# EAGLE design PSU200A_Ctrl (EAGLE 9.5.2)
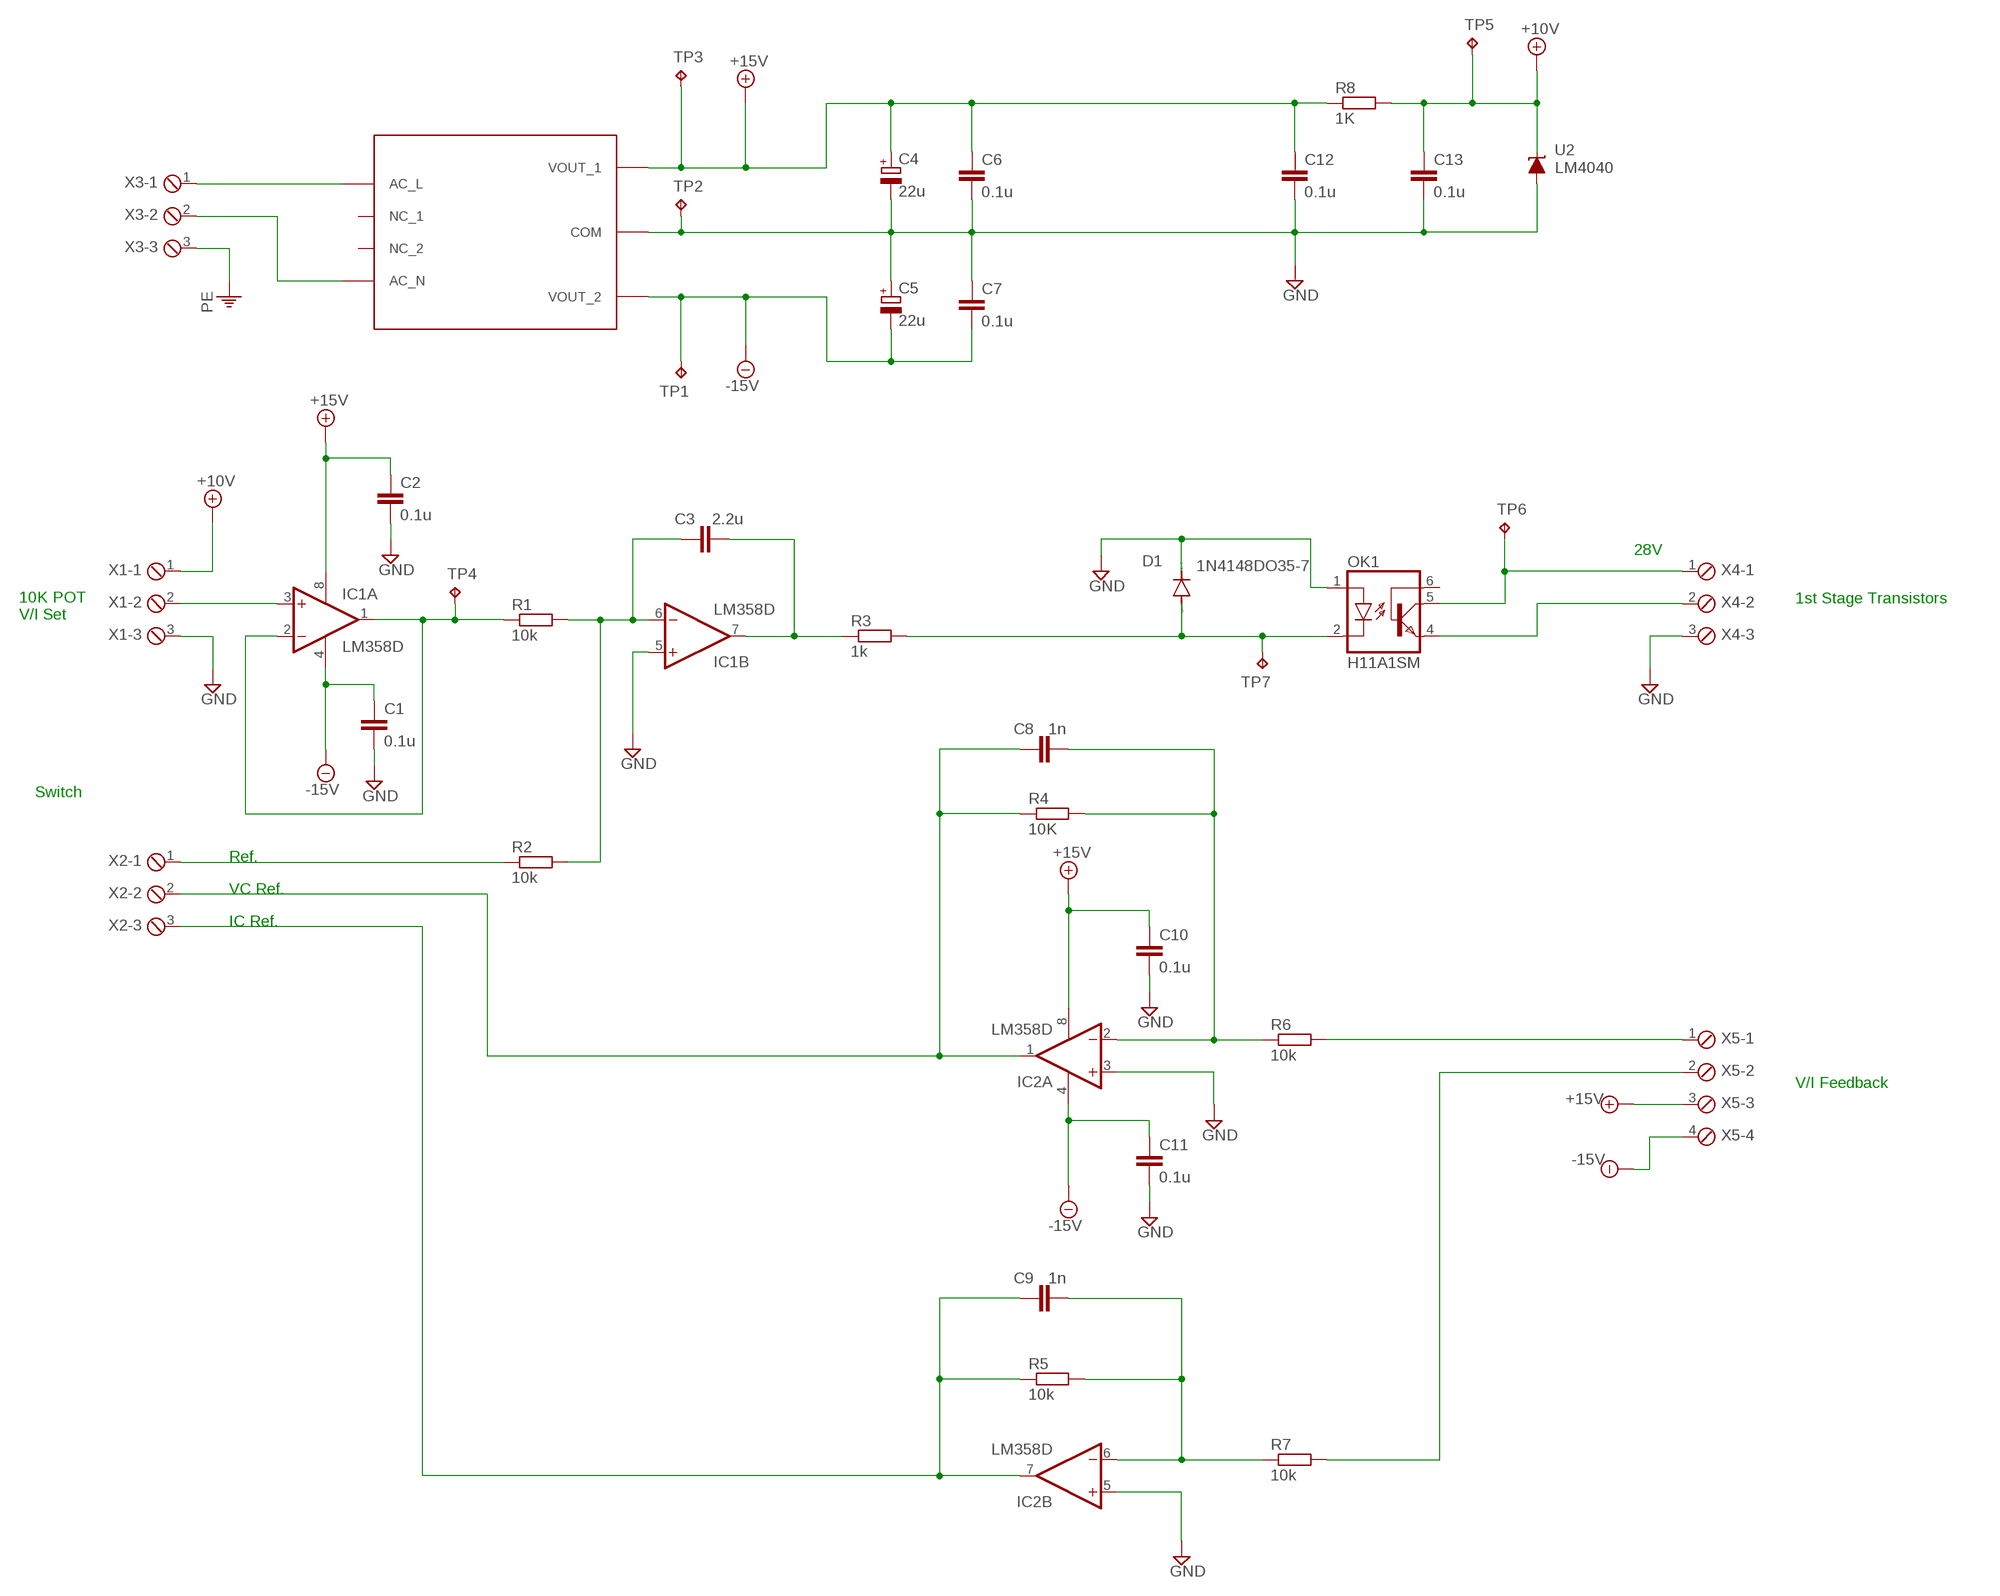
[diagram p0: schematic, sheet 1]

## Parts
C1  0.1u  C-EUC1206  [C1206]
C2  0.1u  C-EUC1206  [C1206]
C3  2.2u  C-EUC1206  [C1206]
C4  22u  CPOL-EUB  [PANASONIC_B]
C5  22u  CPOL-EUB  [PANASONIC_B]
C6  0.1u  C-EUC1206  [C1206]
C7  0.1u  C-EUC1206  [C1206]
C8  1n  C-EUC1206  [C1206]
C9  1n  C-EUC1206  [C1206]
C10  0.1u  C-EUC1206  [C1206]
C11  0.1u  C-EUC1206  [C1206]
C12  0.1u  C-EUC1206  [C1206]
C13  0.1u  C-EUC1206  [C1206]
D1  1N4148DO35-7  [DO35-7]
IC1  LM358D  [SO08]
IC2  LM358D  [SO08]
OK1  H11A1SM  [DIL6-SMD]
R1  10k  R-EU_R1206  [R1206]
R2  10k  R-EU_R1206  [R1206]
R3  1k  R-EU_R1206  [R1206]
R4  10K  R-EU_R1206  [R1206]
R5  10k  R-EU_R1206  [R1206]
R6  10k  R-EU_R1206  [R1206]
R7  10k  R-EU_R1206  [R1206]
R8  1K  R-EU_R1210  [R1210]
TP1  TPPAD1-13  [P1-13]
TP2  TPPAD1-13  [P1-13]
TP3  TPPAD1-13  [P1-13]
TP4  TPPAD1-13  [P1-13]
TP5  TPPAD1-13  [P1-13]
TP6  TPPAD1-13  [P1-13]
TP7  TPPAD1-13  [P1-13]
U1  TMPM04215  [TMPM04XXX]
U2  LM4040  [TO92-]
X1  MPT3  [3POL254]
X2  MPT3  [3POL254]
X3  MPT3  [3POL254]
X4  MPT3  [3POL254]
X5  MPT4  [4POL254]

## Nets
+10V: C13.1 R8.2 TP5.TP U2.2(C) X1.1
+15V: C2.1 C4.+ C6.1 C10.1 C12.1 IC1.8(P:V+) IC2.8(P:V+) R8.1 TP3.TP U1.P$3(VOUT_1) X5.3
-15V: C1.1 C5.- C7.2 C11.1 IC1.4(P:V-) IC2.4(P:V-) TP1.TP U1.P$5(VOUT_2) X5.4
GND: C1.2 C2.2 C4.- C5.+ C6.2 C7.1 C10.2 C11.2 C12.2 C13.2 D1.C IC1.5(B:+IN) IC2.3(A:+IN) IC2.5(B:+IN) OK1.1(A) TP2.TP U1.P$4(COM) U2.3(A) X1.3 X4.3
N$1: IC1.3(A:+IN) X1.2
N$2: IC1.1(A:OUT) IC1.2(A:-IN) R1.1 TP4.TP
N$3: C3.1 IC1.6(B:-IN) R1.2 R2.2
N$4: C3.2 IC1.7(B:OUT) R3.1
N$5: R2.1 X2.1
N$6: C9.1 IC2.7(B:OUT) R5.1 X2.3
N$7: D1.A OK1.2(C) R3.2 TP7.TP
N$8: OK1.5(COL) TP6.TP X4.1
N$9: OK1.4(EMI) X4.2
N$10: R6.2 X5.1
N$11: C8.2 IC2.2(A:-IN) R4.2 R6.1
N$12: C8.1 IC2.1(A:OUT) R4.1 X2.2
N$13: U1.P$7(AC_L) X3.1
N$15: U1.P$6(AC_N) X3.2
N$17: R7.2 X5.2
N$18: C9.2 IC2.6(B:-IN) R5.2 R7.1
PE: X3.3
Unconnected: OK1.6(BAS) U1.P$1(NC_1) U1.P$2(NC_2)

## Notes on the sheet
- 28V
- 1st Stage Transistors
- 10K POT
  V/I Set
- Switch
- Ref.
- VC Ref.
- IC Ref.
- V/I Feedback

## Library data of the parts
C1-C3 C6-C13 = rcl:C-EU: CAPACITOR, European symbol; SPICEPREFIX: C
C4 C5 = rcl:CPOL-EU: POLARIZED CAPACITOR, European symbol; SPICEPREFIX: C
D1 = diode:1N4148: DIODE high speed (Philips)
IC1 IC2 = linear:LM358: OP AMP also LM158; LM258; LM2904 Source: http://cache.national.com/ds/LM/LM158.pdf
OK1 = optocoupler:H11A*?M: General Purpose 6-Pin Phototransistor Optocouplers Source: http://www.fairchildsemi.com/ds/4N/4N35-M.pdf; OC_FARNELL: unknown; OC_NEWARK: unknown
R1-R8 = rcl:R-EU_: RESISTOR, European symbol; SPICEPREFIX: R
TP1-TP7 = testpad:TP: Test pad
U1 = myLibs:TMPM04215
U2 = PSU200A_Ctrl:LM4040
X1-X4 = con-phoenix-254:MPT3: PHOENIX CONNECTOR; OC_FARNELL: unknown; OC_NEWARK: unknown
X5 = con-phoenix-254:MPT4: PHOENIX CONNECTOR; OC_FARNELL: unknown; OC_NEWARK: unknown

## Board
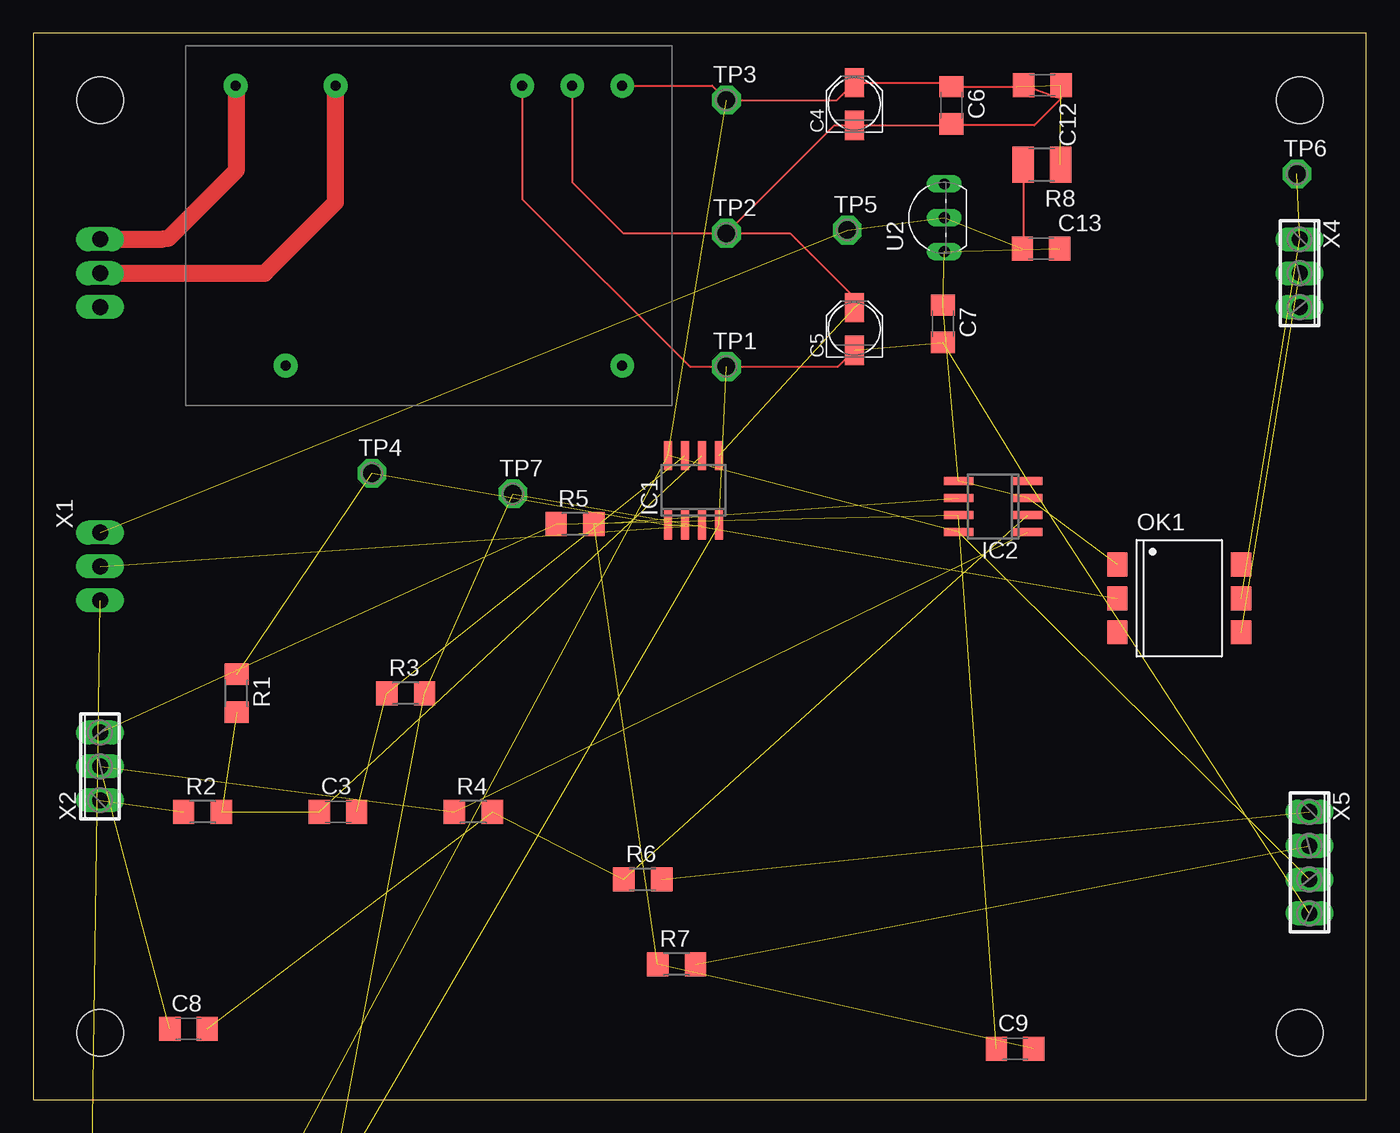
[diagram p1: board, top side]
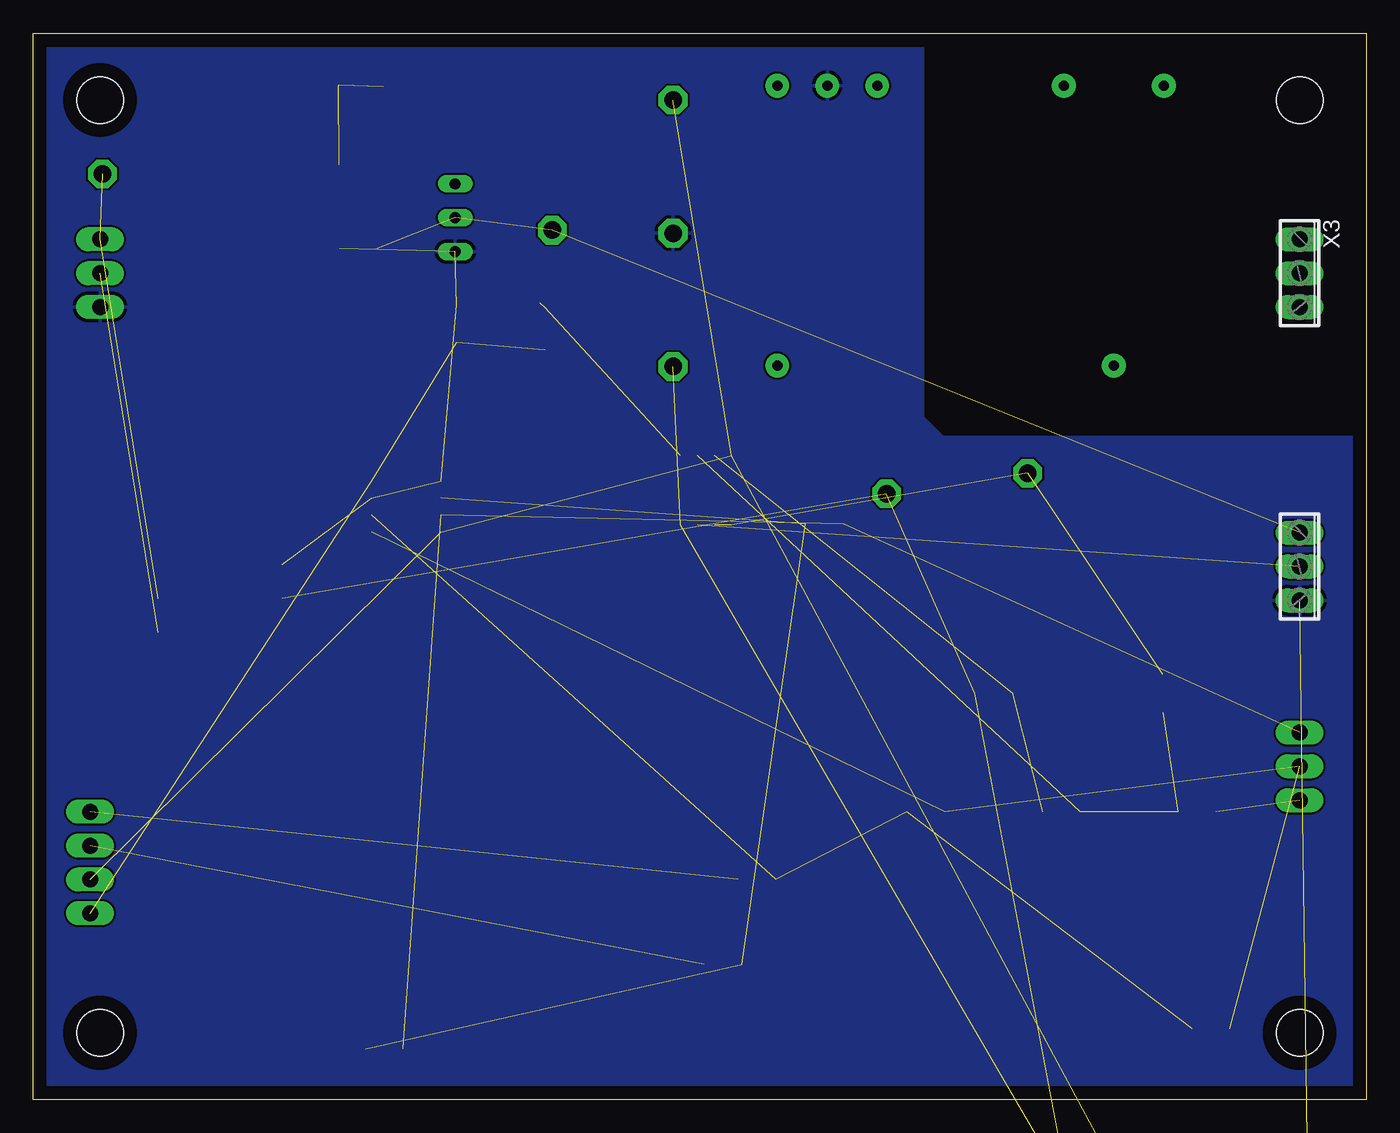
[diagram p2: board, bottom side, seen from below]

Size 100 x 80 mm. Coordinates in mm from the lower left corner, seen from the top.
Outline: 0,0 100,0 100,80 0,80 0,0
Copper layers (1*16): Top 0.035mm / dielectric 1.5mm / Bottom 0.035mm
Design rules "default": minimum track width 6mil, minimum drill 0.35mm, track to track 6mil, track to pad 6mil, pad to pad 6mil, via to via 6mil, smd to smd 6mil, copper to edge 40mil, drill to drill 6mil, minimum pad ring 10mil, minimum via ring 8mil, stop-mask expansion 4mil, vias tented up to drill 0mil, thermal gap 10mil
Holes 3.5 mm at 5,75 95,75 5,5 95,5

### Footprints (pad centres in the part's own frame; a part is rotated, then mirrored left to right if it is on the bottom)
C1206 = smd 1.6 x 1.8: 1 -1.4,0; 2 1.4,0
PANASONIC_B = smd 2.2 x 1.4: + 1.6,0; - -1.6,0
DO35-7 = drill 0.813 long: A 3.81,0; C -3.81,0
SO08 = smd 0.6 x 2.2: 1 -1.905,-2.6; 2 -0.635,-2.6; 3 0.635,-2.6; 4 1.905,-2.6; 5 1.905,2.6; 6 0.635,2.6; 7 -0.635,2.6; 8 -1.905,2.6
DIL6-SMD = smd 1.78 x 1.52: 1 -2.54,-4.645; 2 0,-4.645; 3 2.54,-4.645; 4 2.54,4.645; 5 0,4.645; 6 -2.54,4.645
R1206 = smd 1.6 x 1.803: 1 -1.422,0; 2 1.422,0
R1210 = smd 1.6 x 2.7: 1 -1.4,0; 2 1.4,0
P1-13 = drill 1.321 pad 2.159 octagon: TP 0,0
TMPM04XXX = drill 0.75 pad 1.778: P$1 7.5,3; P$2 32.75,3; P$3 32.75,24; P$4 29,24; P$5 25.25,24; P$6 11.25,24; P$7 3.75,24
TO92- = drill 0.813 long: 1 2.54,0; 2 0,0; 3 -2.54,0
3POL254 = drill 1.2 long: 1 -2.54,0; 2 0,0; 3 2.54,0
4POL254 = drill 1.2 long: 1 -3.81,0; 2 -1.27,0; 3 1.27,0; 4 3.81,0

### Placement (x,y rotation side)
C1  2.54,-64.77 0 top  (outside the outline)
C2  2.54,-58.42 0 top  (outside the outline)
C3  22.86,21.59 0 top
C4  61.6,74.69 90 top
C5  61.6,57.82 90 top
C6  68.87,74.6 270 top
C7  68.23,58.21 270 top
C8  11.64,5.29 0 top
C9  73.66,3.81 0 top
C10  2.54,-38.1 0 top  (outside the outline)
C11  2.54,-43.18 0 top  (outside the outline)
C12  75.71,76.09 180 top
C13  75.61,63.85 0 top
D1  6.35,-71.12 0 top  (outside the outline)
IC1  49.53,45.72 0 top
IC2  72.02,44.5 90 top
OK1  85.97,37.6 270 top
R1  15.24,30.48 270 top
R2  12.7,21.59 0 top
R3  27.94,30.48 0 top
R4  33.02,21.59 0 top
R5  40.64,43.18 0 top
R6  45.72,16.51 0 top
R7  48.26,10.16 0 top
R8  75.67,70.14 180 top
TP1  52,55 0 top
TP2  52,65 0 top
TP3  52,75 0 top
TP4  25.4,46.99 0 top
TP5  61.07,65.24 0 top
TP6  94.81,69.45 0 top
TP7  35.98,45.45 0 top
U1  11.43,52.07 0 top
U2  68.35,66.16 90 top
X1  5,40 270 bottom
X2  5,25 90 top
X3  5,62 270 bottom
X4  95,62 270 top
X5  95.74,17.78 270 top

### Tracks (layer width: path | path; a pad name or v marks a point on that pad's centre or on a via)
+10V  (3 unrouted)
  Top 0.152: R8.2 74.27,63.91 C13.1
+15V  (7 unrouted)
  Top 0.152: U1.P$3 50.93,76.07 TP3.TP 60.31,75 C4.+ 68.58,76.29 C6.1 73.75,76
-15V  (6 unrouted)
  Top 0.152: U1.P$5 36.68,67.57 49.25,55 TP1.TP 60.38,55 C5.-
GND  (12 unrouted)
  Top 0.152: U1.P$4 40.43,68.82 44.25,65 TP2.TP | TP2.TP 56.75,65 62,59.75 | TP2.TP 60.09,73.09 C4.- 68.76,73.09 | 68.76,73.09 C6.2 | C12.2 77.11,75.11 75.09,73.09 68.76,73.09
  pour Bottom: 33.25,79.75 33.25,51.25 31.75,49.75 0.25,49.75 0.25,0.5 0.25,0.25 99.75,0.25 99.75,8.75 99.75,79.75
N$1  (1 unrouted)
N$2  (3 unrouted)
N$3  (3 unrouted)
N$4  (2 unrouted)
N$5  (1 unrouted)
N$6  (3 unrouted)
N$7  (3 unrouted)
N$8  (2 unrouted)
N$9  (1 unrouted)
N$10  (1 unrouted)
N$11  (3 unrouted)
N$12  (3 unrouted)
N$13
  Top 0.152: 15.25,75.96 15.16,76.05
  Top 1.27: 15.16,76.05 U1.P$7 | X3.1 9.67,64.54 10.1,64.6 15.25,69.75 15.25,75.96
N$15
  Top 1.27: X3.2 17.36,62 22.68,67.32 U1.P$6
N$17  (1 unrouted)
N$18  (3 unrouted)